# EAGLE design Blocky_STM_Zero (EAGLE 9.1.3)
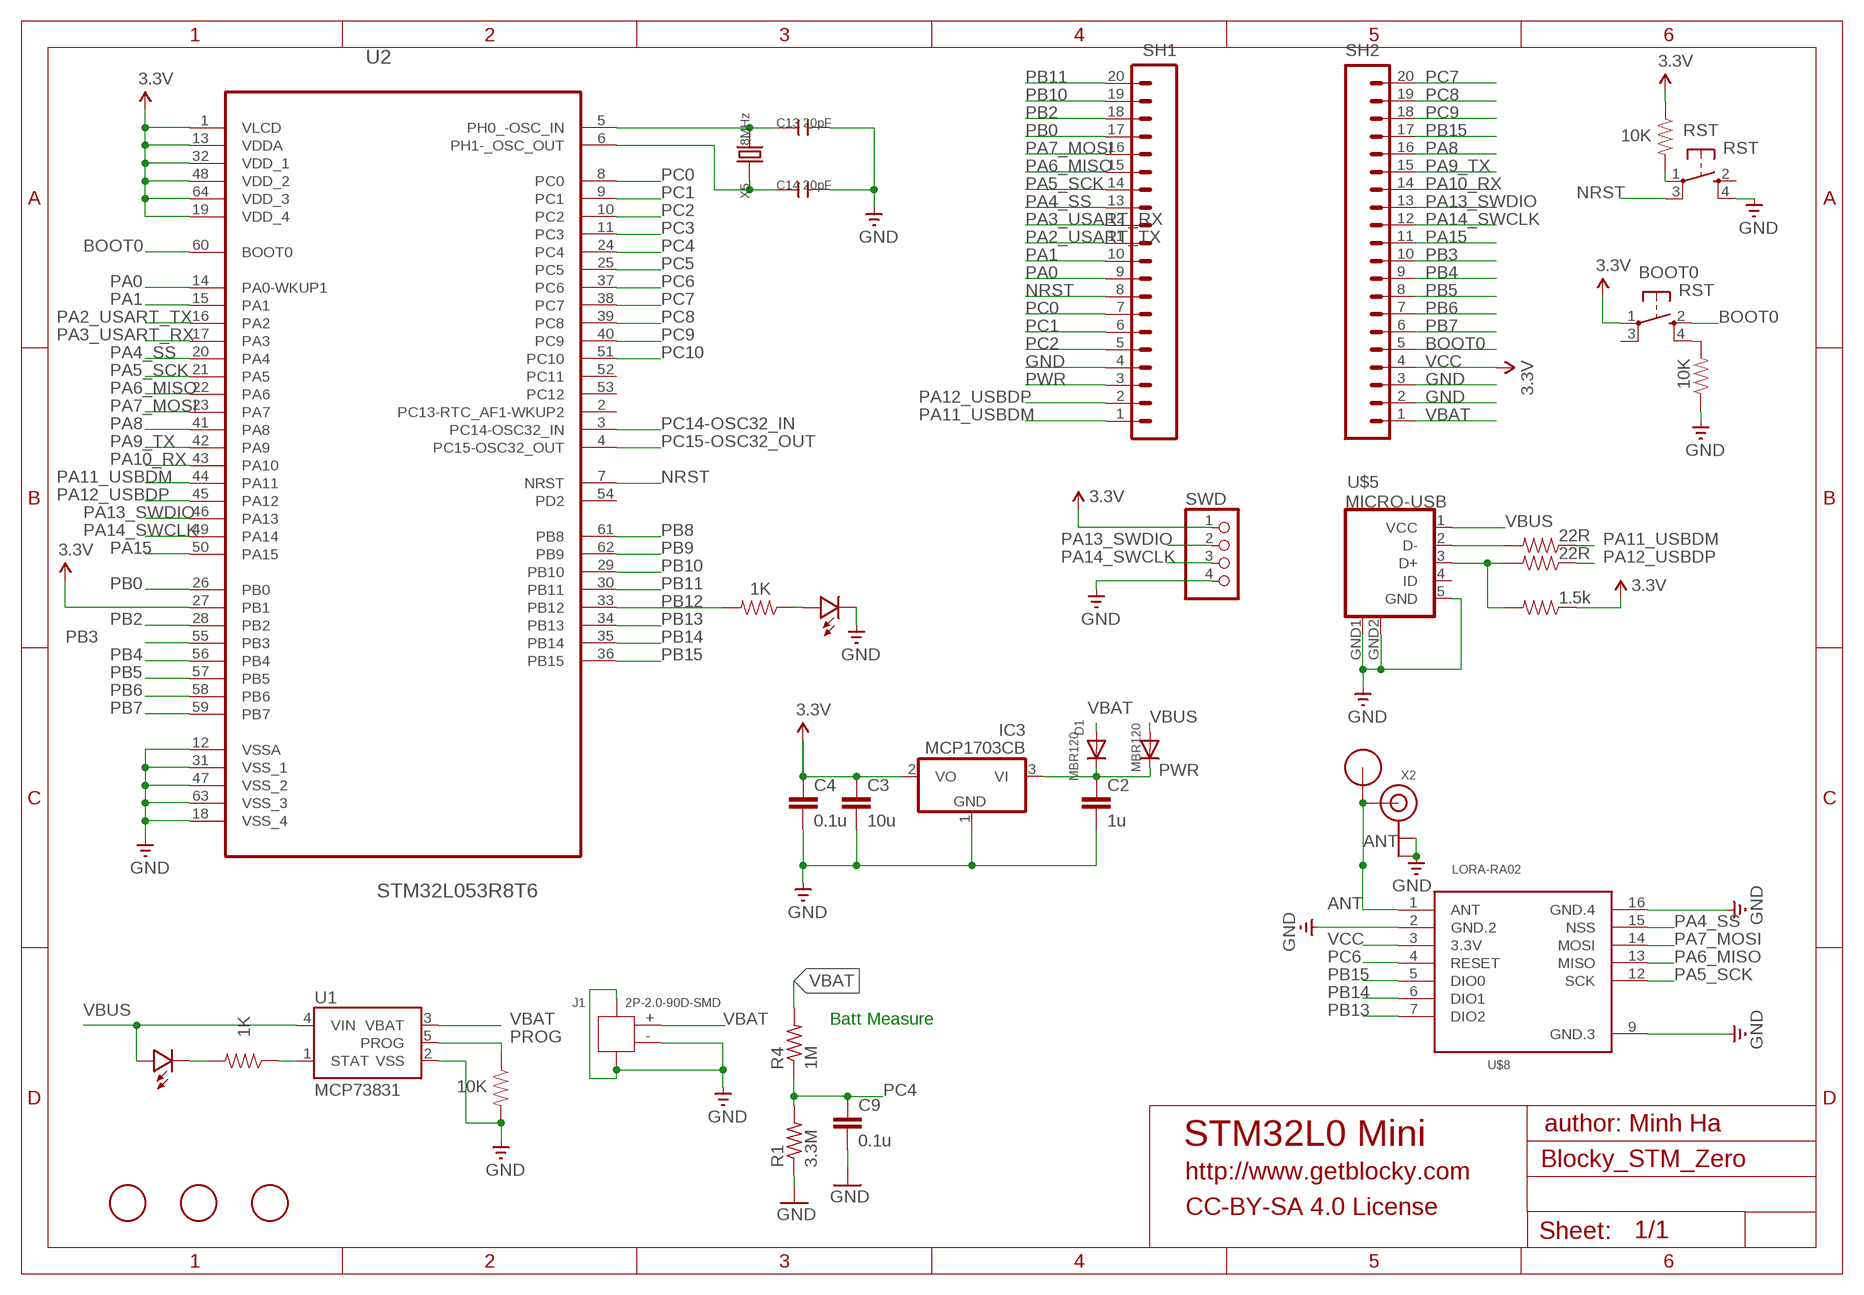
[diagram p0: schematic, sheet 1]

## Parts
BOOT0  RST  SPST_TACT-KMR2  [KMR2]
C2  1u  CAP0603-CAP  [0603-CAP]
C3  10u  CAP0603-CAP  [0603-CAP]
C4  0.1u  CAP0603-CAP  [0603-CAP]
C9  0.1u  CAP0603-CAP  [0603-CAP]
C13  20pF  C-0603  [C0603]
C14  20pF  C-0603  [C0603]
CHGR  RED  LED0603  [0603-LED]
D1  MBR120  DIODESOD-123  [SOD-123]
IC3  MCP1703CB  [SOT23]
J1  2P-2.0-90D-SMD  CONN-HEADER-SMD-PH-SIDE-(2P-2.0MM)  [HW2-SMD-2.0-90D]
MBR0001  MBR120  DIODESOD-123  [SOD-123]
R1  3.3M  R-US_R0603  [R0603]
R2  1K  RESISTOR0603-RES  [0603-RES]
R3  22R  RESISTOR0603-RES  [0603-RES]
R4  1M  R-US_R0603  [R0603]
R5  1K  RESISTOR0603-RES  [0603-RES]
R6  10K  RESISTOR0603-RES  [0603-RES]
R7  22R  RESISTOR0603-RES  [0603-RES]
R8  1.5k  RESISTOR0603-RES  [0603-RES]
R9  10K  RESISTOR0603-RES  [0603-RES]
R10  10K  RESISTOR0603-RES  [0603-RES]
RST  RST  SPST_TACT-KMR2  [KMR2]
SH1  M20  [1X20]
SH2  M20  [1X20]
SWD  HEADER-1X4ROUND  [1X04_ROUND]
U1  MCP73831  [SOT23-5]
U2  STM32L053R8T6  STM32L152RBT6  [QFP50P1200X1200X160-64N]
U$1  RFM12B_ANTENNA  [RFM12B-ANTENNA]
U$2  FIDUCIAL  [FIDUCIAL_1MM]
U$4  FIDUCIAL  [FIDUCIAL_1MM]
U$5  MICRO-USB  [MICRO-USB]
U$6  LED0603  [0603-LED]
U$7  FIDUCIAL  [FIDUCIAL_1MM]
U$8  LORA-RA02  LORA-RA-02-433MHZ  [LORA-RA2-SMD]
X2  ANTENNA_U.FL  [U.FL]
X5  8MHz  CRYSTAL'5032'  [2P-SMD-5X3.2]

## Nets
ANT [power]: U$1.P$1 U$8.1(ANT) X2.3(SIGNAL)
BOOT0: BOOT0.2(S) SH2.5 U2.60(BOOT0)
GND: C2.2 C3.2 C4.2 C9.2 C13.2 C14.2 IC3.1(GND) J1.3 J1.4 J1.- R1.1 R6.2 R9.1 RST.4(S1) SH1.4 SH2.2 SH2.3 SWD.4 U1.2(VSS) U2.12(VSSA) U2.18(VSS_4) U2.31(VSS_1) U2.47(VSS_2) U2.63(VSS_3) U$5.5(GND) U$5.GND1(GND) U$5.GND2(GND) U$6.MINUS U$8.2(GND.2) U$8.9(GND.3) U$8.16(GND.4) X2.1(GND) X2.2(GND)
N$1: BOOT0.4(S1) R9.2
N$2: R2.1 U$6.PLUS
N$9: CHGR.MINUS R5.2
NRST: RST.3(P1) SH1.8 U2.7(NRST)
OSC_IN: C13.1 U2.5(PH0_-OSC_IN) X5.2
OSC_OUT: C14.1 U2.6(PH1-_OSC_OUT) X5.1
PA0: SH1.9 U2.14(PA0-WKUP1)
PA1: SH1.10 U2.15(PA1)
PA2_USART_TX: SH1.11 U2.16(PA2)
PA3_USART_RX: SH1.12 U2.17(PA3)
PA4_SS: SH1.13 U2.20(PA4) U$8.15(NSS)
PA5_SCK: SH1.14 U2.21(PA5) U$8.12(SCK)
PA6_MISO: SH1.15 U2.22(PA6) U$8.13(MISO)
PA7_MOSI: SH1.16 U2.23(PA7) U$8.14(MOSI)
PA8: SH2.16 U2.41(PA8)
PA9_TX: SH2.15 U2.42(PA9)
PA10_RX: SH2.14 U2.43(PA10)
PA11_USBDM: R3.1 SH1.1 U2.44(PA11)
PA12_USBDP: R7.1 SH1.2 U2.45(PA12)
PA13_SWDIO: SH2.13 SWD.2 U2.46(PA13)
PA14_SWCLK: SH2.12 SWD.3 U2.49(PA14)
PA15: SH2.11 U2.50(PA15)
PB0: SH1.17 U2.26(PB0)
PB2: SH1.18 U2.28(PB2)
PB3: SH2.10 U2.55(PB3)
PB4: SH2.9 U2.56(PB4)
PB5: SH2.8 U2.57(PB5)
PB6: SH2.7 U2.58(PB6)
PB7: SH2.6 U2.59(PB7)
PB8: U2.61(PB8)
PB9: U2.62(PB9)
PB10: SH1.19 U2.29(PB10)
PB11: SH1.20 U2.30(PB11)
PB12: R2.2 U2.33(PB12)
PB13: U2.34(PB13) U$8.7(DIO2)
PB14: U2.35(PB14) U$8.6(DIO1)
PB15: SH2.17 U2.36(PB15) U$8.5(DIO0)
PC0: SH1.7 U2.8(PC0)
PC1: SH1.6 U2.9(PC1)
PC2: SH1.5 U2.10(PC2)
PC3: U2.11(PC3)
PC4: C9.1 R1.2 R4.1 U2.24(PC4)
PC5: U2.25(PC5)
PC6: U2.37(PC6) U$8.4(RESET)
PC7: SH2.20 U2.38(PC7)
PC8: SH2.19 U2.39(PC8)
PC9: SH2.18 U2.40(PC9)
PC10: U2.51(PC10)
PC14-OSC32_IN: U2.3(PC14-OSC32_IN)
PC15-OSC32_OUT: U2.4(PC15-OSC32_OUT)
PROG: R6.1 U1.5(PROG)
PWR [power]: C2.1 D1.C IC3.3(VI) MBR0001.C SH1.3
RST_1: R10.2 RST.1(P)
STAT: R5.1 U1.1(STAT)
USB_D+: R7.2 R8.2 U$5.3(D+)
USB_D-: R3.2 U$5.2(D-)
VBAT [power]: D1.A J1.+ R4.2 SH2.1 U1.3(VBAT)
VBUS [usbvcc]: CHGR.PLUS MBR0001.A U1.4(VIN) U$5.1(VCC)
VCC [power]: BOOT0.1(P) C3.1 C4.1 IC3.2(VO) R8.1 R10.1 SH2.4 SWD.1 U2.1(VLCD) U2.13(VDDA) U2.19(VDD_4) U2.27(PB1) U2.32(VDD_1) U2.48(VDD_2) U2.64(VDD_3) U$8.3(3.3V) ; supply symbol labelled 3.3V
Unconnected: BOOT0.3(P1) RST.2(S) U2.2(PC13-RTC_AF1-WKUP2) U2.52(PC11) U2.53(PC12) U2.54(PD2) U$5.4(ID)

## Notes on the sheet
- Batt Measure
- author: Minh Ha
- STM32L0 Mini
- http://www.getblocky.com
- CC-BY-SA 4.0 License

## Library data of the parts
BOOT0 RST = adafruit:SPST_TACT: SMT 6mm switch, EVQQ2 series http://www.ladyada.net/library/eagle
C2-C4 C9 = LowPowerLab:CAP: Capacitor Standard 0603 ceramic capacitor, and 0.1" leaded capacitor.
C13 C14 = Discrete:C*: Ceramic Capacitors
CHGR U$6 = LowPowerLab:LED
D1 MBR0001 = adafruit:DIODE: Diode SMADIODE - SMA Surface Mount Package 20V 1A Schottky Diode Digikey: 641-1014-6-ND DO-1N4148 - Through Hole Small Current Diode SOD-123 20V 1 A (.5mV Vf) Schottky Diode - Digikey: MBRX120TPMSCT-ND SOD-323 10V 570mA (.38mV Vf, 3ns) Schottky Diode - Digikey: ZLLS410CT-ND SOD-523 30V 30mA Schottky Diode (RB751S-40TE61) - Digikey: RB751S-40TE61CT-ND SOT23-R/W - SOT23 Package (R = Solder Paste/Reflow Ovens, W = Hand-Soldering) BAT54Film 40V 300mA - Digikey: 497-7162-1-ND
IC3 = linear:MCP1703: 250 mA, 16V, Low Quiescent Current LDO Regulator Source: http://ww1.microchip.com/downloads/en/DeviceDoc/22049b.pdf
J1 = Seeed-Connector:CONN-HEADER-SMD-PH-SIDE-(2P-2.0MM): 320110026
R1 R4 = adafruit:R-US_: RESISTOR, American symbol
R2 R3 R5-R10 = LowPowerLab:RESISTOR: Resistor Basic schematic elements and footprints for 0603, 1206, and PTH resistors.
SH1 SH2 = SparkFun-Connectors:M20: 1x20 .1" header This is just like the LOCK variant in that the holes are staggared by 5 mil, but except for the last two holes. They are not altered from the "standard" footprint layout. This is used for a special purpose on the layout of our Graphic LCD Backpack. Make sure you want to use this device before selecting it for you project!
SWD = microbuilder:HEADER-1X4: PIN HEADER
U1 = SparkFun-PowerIC:MCP73831: Miniature single cell, fully integrated Li-Ion, Li-polymer charge management controller http://ww1.microchip.com/downloads/en/DeviceDoc/20001984g.pdf IC-09995; PROD_ID: IC-09995
U2 = PatternAgents-STM:STM32L152RBT6: STM32L152RBT6 ARM-based 32-bit MCU, 16 to 64-KB Flash, timers, ADC, DAC and communication interfaces, 2.0-3.6 V PatternAgents ST Microelectronics Component Library Source LBR : http://www.patternagents.com Github : https://github.com/patternagents License : http://creativecommons.org/licenses/by-sa/4.0/ (Creative Commons 4.0) THIS SOFTWARE IS PROVIDED BY THE CONTRIBUTORS "AS IS" AND WITHOUT ANY EXPRESS OR IMPLIED WARRANTIES, INCLUDING, BUT NOT LIMITED TO, THE IMPLIED WARRANTIES OF MERCHANTABILITY AND FITNESS FOR A PARTICULAR PURPOSE ARE DISCLAIMED. IN NO EVENT SHALL THE COPYRIGHT OWNER OR CONTRIBUTORS BE LIABLE FOR ANY DIRECT, INDIRECT, INCIDENTAL, SPECIAL, EXEMPLARY, OR CONSEQUENTIAL DAMAGES (INCLUDING, BUT NOT LIMITED TO, PROCUREMENT OF SUBSTITUTE GOODS OR SERVICES; LOSS OF USE, DATA, OR PROFITS; OR BUSINESS INTERRUPTION) HOWEVER CAUSED AND ON ANY THEORY OF LIABILITY, WHETHER IN CONTRACT, STRICT LIABILITY, OR TORT (INCLUDING NEGLIGENCE OR OTHERWISE) ARISING IN ANY WAY OUT OF THE USE OF THIS SOFTWARE, EVEN IF ADVISED OF THE POSSIBILITY OF SUCH DAMAGE.; MPN: STM32L152RBT6; PACKAGE: QFP-64; SUPPLIER: STMICROELECTRONICS
U$1 = LowPowerLab:RFM12B_ANTENNA
U$2 U$4 U$7 = adafruit:FIDUCIAL: For use by pick and place machines to calibrate the vision/machine, 1mm By microbuilder.eu
U$5 = My-Eagle-Lib:MICRO-USB: Micro USB B connector
U$8 = LikeCircuit:LORA-RA-02-433MHZ: 433 MHz Lora Ra-02 Radio Transceiver Module based on SX1276 chip. Visit our more eagle PCB <https://www.likecircuit.com/>
X2 = adafruit:ANTENNA_U.FL: U.FL Antenna Connector
X5 = Discrete:CRYSTAL*: CRYSTAL

## Net classes
1 power: width 0.203 mm, clearance 0.203 mm
3 usbvcc: width 0.203 mm, drill 0.305 mm, clearance 0.203 mm

## Board
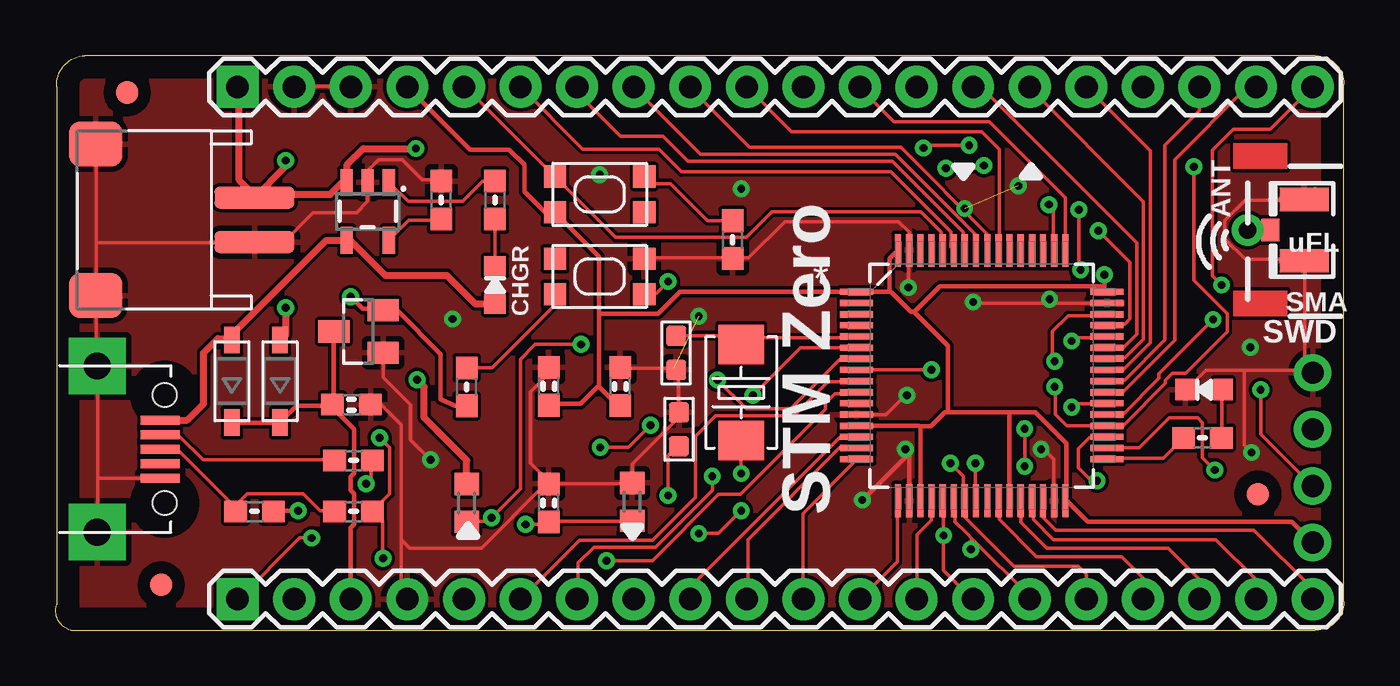
[diagram p1: board, top side]
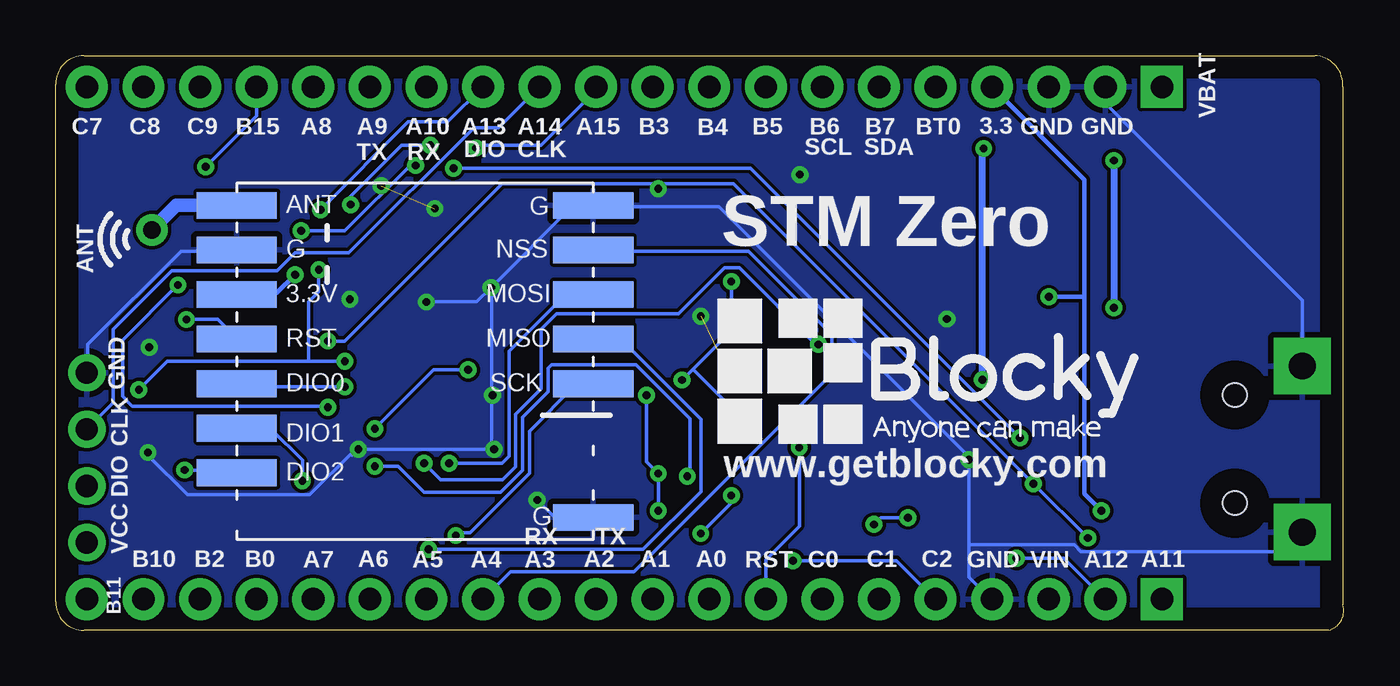
[diagram p2: board, bottom side, seen from below]

Size 57.82 x 25.78 mm. Coordinates in mm from the lower left corner, seen from the top.
Outline: 0.67,0 56.55,0 arc90 57.82,1.27 57.82,24.51 arc90 56.55,25.78 1.31,25.78 arc90 0.04,24.38 0.04,1.14 arc90 0.67,0
Copper layers (1*16): Top 0.035mm / dielectric 1.5mm / Bottom 0.035mm
Design rules "default": minimum track width 6mil, minimum drill 0.35mm, track to track 6mil, track to pad 6mil, pad to pad 6mil, via to via 6mil, smd to smd 6mil, copper to edge 40mil, drill to drill 6mil, minimum pad ring 10mil, minimum via ring 8mil, stop-mask expansion 4mil, vias tented up to drill 0mil, thermal gap 10mil

### Footprints (pad centres in the part's own frame; a part is rotated, then mirrored left to right if it is on the bottom)
KMR2 = smd 1 x 1: 1 2,0.8; 2 2,-0.8; 3 -2,0.8; 4 -2,-0.8
0603-CAP = smd 1.016 x 0.965: 1 -0.85,0; 2 0.85,0
C0603 = smd 0.889 x 0.889: 1 -0.762,0; 2 0.762,0
0603-LED = smd 0.864 x 0.965: MINUS -0.85,0; PLUS 0.85,0
SOD-123 = smd 1.2 x 0.7: A 1.85,0; C -1.85,0
SOT23 = smd 1 x 1.4: 1 -0.95,-1.1; 2 0.95,-1.1; 3 0,1.1
HW2-SMD-2.0-90D = smd 2 x 2.4: 3 3.4,-2.181; 4 -3.4,-2.181 | smd 1 x 3.6: + -1,4.953; - 1,4.953
R0603 = smd 1 x 1.1: 1 -0.85,0; 2 0.85,0
0603-RES = smd 1.016 x 0.965: 1 -0.85,0; 2 0.85,0
1X20 = drill 1.016 pad 1.88 square: 1 0,0 | drill 1.016 pad 1.88: 2 2.54,0; 3 5.08,0; 4 7.62,0; 5 10.16,0; 6 12.7,0; 7 15.24,0; 8 17.78,0; 9 20.32,0; 10 22.86,0; 11 25.4,0; 12 27.94,0; 13 30.48,0; 14 33.02,0; 15 35.56,0; 16 38.1,0; 17 40.64,0; 18 43.18,0; 19 45.72,0; 20 48.26,0
1X04_ROUND = drill 1 pad 1.676: 1 -3.81,0; 2 -1.27,0; 3 1.27,0; 4 3.81,0
SOT23-5 = smd 0.55 x 1.2: 1 -0.95,-1.3; 2 0,-1.3; 3 0.95,-1.3; 4 0.95,1.3; 5 -0.95,1.3
QFP50P1200X1200X160-64N = smd 1.473 x 0.279: 1 -5.613,3.759; 2 -5.613,3.251; 3 -5.613,2.743; 4 -5.613,2.261; 5 -5.613,1.753; 6 -5.613,1.245; 7 -5.613,0.762; 8 -5.613,0.254; 9 -5.613,-0.254; 10 -5.613,-0.762; 11 -5.613,-1.245; 12 -5.613,-1.753; 13 -5.613,-2.261; 14 -5.613,-2.743; 15 -5.613,-3.251; 16 -5.613,-3.759; 33 5.613,-3.759; 34 5.613,-3.251; 35 5.613,-2.743; 36 5.613,-2.261; 37 5.613,-1.753; 38 5.613,-1.245; 39 5.613,-0.762; 40 5.613,-0.254; 41 5.613,0.254; 42 5.613,0.762; 43 5.613,1.245; 44 5.613,1.753; 45 5.613,2.261; 46 5.613,2.743; 47 5.613,3.251; 48 5.613,3.759 | smd 0.279 x 1.473: 17 -3.759,-5.613; 18 -3.251,-5.613; 19 -2.743,-5.613; 20 -2.261,-5.613; 21 -1.753,-5.613; 22 -1.245,-5.613; 23 -0.762,-5.613; 24 -0.254,-5.613; 25 0.254,-5.613; 26 0.762,-5.613; 27 1.245,-5.613; 28 1.753,-5.613; 29 2.261,-5.613; 30 2.743,-5.613; 31 3.251,-5.613; 32 3.759,-5.613; 49 3.759,5.613; 50 3.251,5.613; 51 2.743,5.613; 52 2.261,5.613; 53 1.753,5.613; 54 1.245,5.613; 55 0.762,5.613; 56 0.254,5.613; 57 -0.254,5.613; 58 -0.762,5.613; 59 -1.245,5.613; 60 -1.753,5.613; 61 -2.261,5.613; 62 -2.743,5.613; 63 -3.251,5.613; 64 -3.759,5.613
RFM12B-ANTENNA = drill 0.8 pad 1.422: P$1 0,0
FIDUCIAL_1MM = smd 1 x 1: 1 0,0
MICRO-USB = smd 0.4 x 1.75: 1 -1.3,4.525; 2 -0.65,4.525; 3 0,4.525; 4 0.65,4.525; 5 1.3,4.525 | drill 1.2 pad 2.54 square: GND1 -3.725,1.7; GND2 3.725,1.7 | hole 1.05: -2.425,4.73; 2.425,4.73
LORA-RA2-SMD = smd 3.6 x 1.2: 1 -8,7; 2 -8,5; 3 -8,3; 4 -8,1; 5 -8,-1; 6 -8,-3; 7 -8,-5; 9 8,-7; 12 8,-1; 13 8,1; 14 8,3; 15 8,5; 16 8,7
U.FL = smd 2.2 x 1.05: 1 0,1.375; 2 0,-1.375 | smd 0.8 x 1: 3 1.525,0
2P-SMD-5X3.2 = smd 1.778 x 2.032: 1 -2.159,0; 2 2.159,0

### Placement (x,y rotation side)
BOOT0  24.42,19.56 180 top
C2  13.28,10.12 0 top
C3  25.34,10.94 90 top
C4  22.13,10.95 90 top
C9  22.13,5.71 90 top
C13  27.85,12.45 270 top
C14  27.98,9.02 90 top
CHGR  19.72,15.49 270 top
D1  10.07,11.18 90 top
IC3  13.59,13.41 90 top
J1  3.97,18.42 270 top
MBR0001  7.91,11.18 90 top
R1  25.87,5.76 270 top
R2  51.47,8.64 180 top
R3  13.37,7.62 180 top
R4  18.45,5.71 90 top
R5  19.72,19.3 270 top
R6  17.31,19.3 90 top
R7  13.37,5.33 180 top
R8  8.93,5.33 180 top
R9  30.39,17.53 90 top
R10  18.45,10.92 90 top
RST  24.42,15.87 180 top
SH1  8.16,1.4 0 top
SH2  8.16,24.38 0 top
SWD  56.42,7.75 90 top
U1  14.01,18.8 180 top
U2  41.56,11.43 0 top
U$1  53.5,17.96 0 top
U$2  53.97,6.1 0 top
U$3  [BLOCKY_LOGO]  29.12,8.13 0 bottom
U$4  4.73,2.03 0 top
U$5  0.16,8.13 270 top
U$6  51.55,10.79 0 top
U$7  3.21,24.13 0 top
U$8  41.69,12.06 0 bottom
X2  56.04,17.96 180 top
X5  30.77,10.67 90 top

### Tracks (layer width: path | path; a pad name or v marks a point on that pad's centre or on a via)
ANT
  Top 0.203: X2.3 54.47,18.01 53.55,18.01 U$1.P$1
  Bottom 0.203: 53.48,18.01 U$1.P$1
  Bottom 0.61: U$8.1 52.42,19.07 53.48,18.01
BOOT0
  Top 0.152: SH2.5 18.35,24.41 22.39,20.37 BOOT0.2 22.46,20.3 25.13,17.63 31,17.63 32.14,18.77 38.85,18.77 39.76,17.86 39.76,17.09 U2.60
GND  (via drill 0.35)  (2 unrouted)
  Top 0.152: U2.12 37.27,9.68 38.01,10.41 38.09,10.41 v38.21,10.54 | v38.28,15.38 38.28,17.01 U2.63 38.31,17.09 38.31,17.86 37.83,18.34 32.73,18.34 31.1,16.71 30.39,16.71 | v41.18,14.73 41.23,14.68 U2.47 | U2.31 44.82,7.67 44.36,8.13 v44.23,8.13 | 56.07,11.53 56.37,11.53 SWD.4 56.07,11.53 | 56.07,11.66 53.35,11.66 | U$6.MINUS 50.73,10.85 50.81,10.85 51.62,11.66 52.97,11.66 53.1,11.66 53.35,11.66 | 56.07,11.66 56.07,16.51 | 56.07,16.51 56.07,16.56 X2.1 55.99,16.64 53.4,16.64 52.49,17.55 52.49,18.39 53.4,19.3 55.99,19.3 X2.2 56.07,19.38 56.53,19.84 | 30.39,16.71 26.43,16.71 RST.4 | 30.39,16.71 R9.1 30.39,16.71 | 53.35,11.66 53.35,11.53 53.35,8.31 v53.68,7.98 | 27.95,9.78 27.95,11.61 27.87,11.68 C13.2 27.8,11.68 27.72,11.76 25.36,11.76 C3.2 | 27.95,9.78 C14.2 27.95,9.78 | C9.2 22.16,6.58 25.82,6.58 R1.1 25.89,6.66 25.89,7.47 27.95,9.52 27.95,9.78 | C4.2 22.08,11.76 22.08,11.46 21.32,10.69 21.32,7.49 22.16,6.66 C9.2 | 15.5,4.06 15.5,1.4 SH1.4 | 15.5,4.06 15.5,9.22 14.6,10.12 C2.2 | IC3.1 14.69,11.35 15.94,10.11 15.94,8.53 v16.82,7.65 | C9.2 22.08,6.5 21.93,6.5 19.11,3.68 15.89,3.68 15.5,4.06 | R6.2 17.28,20.22 16.44,20.22 15.55,21.11 14.49,21.11 14.01,20.62 14.01,20.14 U1.2 14.01,20.07 14.01,19.25 13.5,18.75 11.55,18.75 10.22,17.42 J1.- 8.9,17.4 1.81,17.4 | SH2.2 10.73,24.41 13.24,24.41 SH2.3 | 1.81,17.4 1.81,15.04 J1.3 1.81,14.96 1.81,11.91 U$5.GND1 1.89,11.84 1.89,6.73 | 1.81,17.4 1.81,21.74 J1.4 | 1.89,6.73 1.89,4.45 U$5.GND2 | U$5.5 1.99,6.83 1.89,6.73 | 56.07,15.6 56.07,16.51 | 56.07,11.53 56.07,11.66
  Top 0.203: U2.18 38.31,7.95 v38.14,8.13 38.14,7.77 v36.21,5.84
  Bottom 0.152: v38.28,15.38 38.26,15.37 38.26,10.59 v38.21,10.54 38.26,10.49 38.26,8.13 | v38.28,15.38 38.92,14.73 v41.18,14.73 | 38.26,8.13 v44.23,8.13 44.51,7.85 44.51,7.98 46.42,6.07 51.9,6.07 53.68,7.85 v53.68,7.98 | U$8.2 49.74,17.02 52.18,17.02 56.37,12.83 56.37,11.61 SWD.4 | v36.21,5.84 35.49,5.13 33.74,5.13 U$8.9 | v38.28,15.38 38.24,15.42 34.66,19 33.74,19 U$8.16 33.67,19 28.05,19 16.7,7.65 v16.82,7.65 16.82,3.83 | 16.82,3.83 16.82,2.39 15.83,1.4 SH1.4 | SH2.2 10.65,24.33 10.65,23.6 1.86,14.81 U$5.GND1 | 16.82,3.83 12.1,3.83 11.8,3.53 2.73,3.53 1.89,4.37 U$5.GND2 | v38.14,8.13 38.26,8.13
  other vias: 17.82,13.97 28.86,14.1 40.8,18.92 44.61,14.86 53.63,12.7 30.77,19.81 43.22,19.94 24.42,20.45
  pour Top: 57.82,25.91 57.82,0 0.04,0 0.04,25.91
  pour Bottom: 0.04,25.91 0.04,0 57.82,0 57.82,25.91
N$1
  Top 0.152: BOOT0.4 26.45,20.04 27.59,20.04 29.26,18.38 R9.2
N$2
  Top 0.152: U$6.PLUS 52.33,10.77 52.33,8.64 R2.1
N$9
  Top 0.152: CHGR.MINUS 19.72,16.41 19.72,18.39 R5.2
NRST  (via drill 0.35)
  Top 0.152: v27.49,15.65 26.96,15.11 26.43,15.11 RST.3 | v29.7,11.23 31,9.93 32.98,9.93 35.19,12.14 35.95,12.14 U2.7 | v26.71,9.19 25.71,8.2 v24.44,8.2
  Bottom 0.152: v27.49,15.65 27.49,13.44 29.19,11.73 29.22,11.71 | v29.7,11.23 29.25,11.68 | 29.25,11.68 29.22,11.71 | v24.44,8.2 24.44,4.67 25.94,3.17 SH1.8 | 29.22,11.71 v26.71,9.19 | 29.25,11.68 29.22,11.71
OSC_IN
  Top 0.152: C13.1 27.87,13.21 30.39,13.21 X5.2 30.77,12.9 31,13.13 35.95,13.13 U2.5
OSC_OUT  (via drill 0.35)
  Top 0.152: v28.86,4.34 29.75,4.34 v30.77,5.36 | v30.77,7.04 30.77,8.48 X5.1 | U2.6 33.44,12.67 v31.3,10.54 | v27.49,6.04 27.49,7.82 27.92,8.25 C14.1
  Bottom 0.152: v30.77,5.36 v30.77,7.04 31.3,7.57 v31.3,10.54 | v28.86,4.34 27.47,5.74 27.47,6.02 v27.49,6.04
PA0
  Top 0.152: SH1.9 28.48,1.93 35.19,8.64 35.95,8.64 U2.14
PA1
  Top 0.152: U2.15 35.19,8.18 31.07,4.06 31.07,1.4 SH1.10
PA2_USART_TX
  Top 0.152: U2.16 35.95,7.65 33.54,5.23 33.54,1.42 SH1.11
PA3_USART_RX
  Top 0.152: SH1.12 37.78,3.07 37.78,5.82 U2.17
PA4_SS
  Top 0.152: SH1.13 38.67,1.4 38.67,4.29 39.3,4.93 U2.20
  Bottom 0.152: U$8.15 33.67,17.02 26.73,17.02 22.97,13.26 22.97,11.51 31.86,2.62 37.4,2.62 38.62,1.4 SH1.13
PA5_SCK  (via drill 0.35)
  Top 0.152: U2.21 39.84,5.82 39.84,4.32 39.84,4.29 v39.86,4.25 39.84,4.27 39.84,2.69 41.13,1.4 SH1.14
  Bottom 0.152: U$8.12 33.74,11 34.5,11 36.56,8.94 36.56,7.04 39.23,4.37 39.79,4.37 39.79,4.32 v39.86,4.25
PA6_MISO  (via drill 0.35)
  Top 0.152: 41.16,4.09 43.72,1.52 SH1.15 | U2.22 40.37,5.82 40.37,4.88 40.9,4.34 41.16,4.09 | 41.16,4.09 41.08,4.01 v41.08,3.63
  Bottom 0.152: v41.08,3.63 31.46,3.63 28.86,6.22 28.86,9.47 32.45,13.06 33.67,13.06 U$8.13
PA7_MOSI  (via drill 0.35)
  Top 0.152: v40.17,7.49 40.75,6.91 40.75,5.82 U2.23 40.83,5.82 40.83,5.06 43.01,2.87 45.91,2.87 46.26,2.51 SH1.16
  Bottom 0.152: U$8.14 33.74,15.04 34.96,15.04 37.48,12.52 37.48,7.81 37.79,7.49 v40.17,7.49
PA8
  Top 0.152: U2.41 47.23,11.68 47.91,11.68 49.13,12.9 49.13,21.51 46.31,24.33 SH2.16
PA9_TX
  Top 0.152: U2.42 47.23,12.22 47.99,12.22 48.83,13.06 48.83,19.23 43.72,24.33 SH2.15
PA10_RX
  Top 0.152: U2.43 47.23,12.67 47.91,12.67 48.52,13.28 48.52,17.4 41.54,24.38 SH2.14
PA11_USBDM  (via drill 0.35)
  Top 0.152: v13.93,6.58 14.16,6.81 14.16,7.57 R3.1 | v11.49,4.14 10.96,4.14 8.21,1.4 SH1.1 | v45.6,12.98 45.76,13.13 47.15,13.13 U2.44
  Bottom 0.152: v11.49,4.14 v13.93,6.58 27.39,20.04 37.78,20.04 44.84,12.98 v45.6,12.98
PA12_USBDP  (via drill 0.35)
  Top 0.152: v46.8,17.93 48.22,16.51 48.22,13.97 47.99,13.74 47.23,13.74 U2.45 | v39.96,20.73 41.54,20.73 v41.67,20.85 | v14.54,8.64 15,8.18 15,6.12 14.23,5.36 R7.1 14.67,4.89 14.67,3.25 v14.69,3.23
  Bottom 0.152: v14.69,3.23 12.56,3.23 10.73,1.4 SH1.2 | v46.8,17.93 44.84,17.93 41.92,20.85 v41.67,20.85 | v39.96,20.73 26.63,20.73 v14.54,8.64
PA13_SWDIO  (via drill 0.35)
  Top 0.152: v54.09,10.79 54.09,8.79 56.37,6.5 SWD.2 | U2.46 47.15,14.12 45.45,14.12 44.74,13.41 44.74,12.17 v44.84,12.06 | v45.93,18.87 45.93,16.26 v46.01,16.18
  Bottom 0.152: 46.47,12.06 52.82,12.06 v54.09,10.79 | 46.47,12.06 v44.84,12.06 | v45.93,18.87 42,22.81 40.22,22.81 SH2.13 | v46.01,16.18 46.01,15.19 46.47,14.73 46.47,12.06
PA14_SWCLK
  Top 0.152: U2.49 45.32,17.09 45.32,19.41 41.92,22.81 37.63,22.81 36.1,24.33 SH2.12
  Bottom 0.152: SWD.3 55.23,10.21 55.23,10.29 55.23,13.51 52.61,16.13 47.89,16.13 47.08,16.94 44.66,16.94 39.05,22.55 38.14,22.55 37.93,22.55 SH2.12
PA15  (via drill 0.35)
  Top 0.152: v44.59,19.1 44.79,18.9 44.79,17.09 U2.50 | v41.01,21.77 39.08,21.77 v38.95,21.64
  Bottom 0.152: v41.01,21.77 42.3,21.77 44.59,19.48 v44.59,19.1 | SH2.11 33.56,24.23 36.03,21.77 38.82,21.77 v38.95,21.64
PB0
  Top 0.152: U2.26 42.35,5.82 42.35,4.98 44.03,3.3 47.86,3.3 48.8,2.36 SH1.17
PB2
  Top 0.152: U2.28 43.32,4.85 44.49,3.68 49.95,3.68 51.34,2.29 SH1.18
PB3
  Top 0.152: U2.55 42.35,17.09 42.35,21.59 41.56,22.38 33.03,22.38 31.07,24.33 SH2.10
PB4
  Top 0.152: U2.56 41.82,17.09 41.82,17.78 37.93,21.67 31.15,21.67 28.48,24.33 SH2.9
PB5
  Top 0.152: U2.57 41.29,17.09 41.29,17.78 37.7,21.36 28.94,21.36 25.97,24.33 SH2.8
PB6
  Top 0.152: U2.58 40.75,17.09 40.75,17.86 37.55,21.06 28.38,21.06 27.26,22.17 25.36,22.17 23.4,24.13 SH2.7
PB7
  Top 0.152: U2.59 40.18,17.18 40.18,17.88 37.48,20.57 28.1,20.57 27.09,21.59 23.66,21.59 SH2.6
PB10
  Top 0.152: U2.29 43.88,5.82 43.88,4.98 44.79,4.06 52.08,4.06 53.88,2.26 SH1.19
PB11
  Top 0.152: U2.30 44.33,5.82 44.33,5.06 44.89,4.5 53.78,4.5 56.42,1.85 SH1.20
PB12
  Top 0.152: R2.2 50.58,8.64 50.58,8.58 49.72,7.72 47.23,7.72 U2.33
PB13  (via drill 0.35)
  Top 0.152: v52.03,7.19 51.47,7.75 51.47,9.32 51.27,9.52 50,9.52 48.65,8.18 47.23,8.18 U2.34
  Bottom 0.152: v52.03,7.19 49.82,7.19 49.74,7.11 U$8.7
PB14  (via drill 0.35)
  Top 0.152: U2.35 47.15,8.64 46.39,8.64 45.91,8.15 45.91,7.29 46.49,6.71 v46.75,6.71
  Bottom 0.152: v46.75,6.71 46.75,7.62 48.14,9.02 49.67,9.02 U$8.6
PB15  (via drill 0.35)
  Top 0.152: v44.84,10.92 44.87,10.9 44.87,9.7 45.4,9.17 47.15,9.17 U2.36 47.23,9.17 47.91,9.17 49.82,11.07 49.82,11.23 50.12,11.53 50.73,11.53 52.59,13.39 52.59,14.2 51.09,15.7 v51.09,20.8
  Bottom 0.152: v44.84,10.92 49.59,10.92 49.67,11 U$8.5 | v51.09,20.8 48.8,23.09 SH2.17
PC0  (via drill 0.35)
  Top 0.152: v39.3,11.68 U2.8 | v43.49,7.37 v43.49,9.04 | SH1.7 23.45,1.4 23.45,3.02 24.17,3.73 26.93,3.73 29.47,6.27 v29.47,6.91
  Bottom 0.152: v39.3,11.68 40.85,11.68 v43.49,9.04 | v43.49,7.37 42.45,7.37 41.29,6.2 37.86,6.2 36.87,7.19 36.87,9.55 35.72,10.69 35.72,11.76 35.57,11.91 31.76,11.91 29.35,9.5 29.35,7.04 v29.47,6.91
PC1
  Top 0.152: SH1.6 23.51,4.04 26.78,4.04 28.71,5.97 28.71,8.71 29.63,9.63 33.13,9.63 34.66,11.15 35.95,11.15 U2.9
PC2  (via drill 0.35)
  Top 0.152: v24.72,3.12 26.78,3.12 29.75,6.1 30.74,6.1 34.55,9.91 34.55,10.18 34.99,10.62 35.95,10.62 U2.10
  Bottom 0.152: v24.72,3.12 20.08,3.12 18.35,1.4 SH1.5
PC4  (via drill 0.35)
  Top 0.152: R1.2 25.82,4.9 22.16,4.9 C9.1 22.08,4.83 22.01,4.75 v21.09,4.75 | R4.1 18.5,4.9 19.42,4.9 v19.57,5.06 20.86,6.35 20.86,12.17 21.52,12.83 v23.58,12.83 | v41.29,7.49 41.29,5.82 U2.24
  Bottom 0.152: v19.57,5.06 20.79,5.06 v21.09,4.75 | v41.29,7.49 40.55,6.76 37.75,6.76 37.17,7.34 37.17,9.7 36.03,10.85 36.03,13.51 35.34,14.2 29.86,14.2 27.8,16.26 27.14,16.26 23.71,12.83 v23.58,12.83
PC6  (via drill 0.35)
  Top 0.152: v51.95,13.94 49.51,11.51 49.51,11.3 47.91,9.7 47.23,9.7 U2.37
  Bottom 0.152: v51.95,13.94 50.56,13.94 49.74,13.13 U$8.4
PC7  (via drill 0.35)
  Top 0.152: v45.6,10.01 45.76,10.16 47.15,10.16 U2.38 | v52.33,15.49 51.93,15.9 51.93,21.54 52.87,22.48 54.52,22.48 SH2.20
  Bottom 0.152: v52.33,15.49 54.82,13 54.82,10.49 54.39,10.06 52.51,10.06 45.65,10.06 v45.6,10.01
PC8
  Top 0.152: U2.39 47.23,10.69 47.91,10.69 50.23,13 50.23,21.11 53.45,24.33 53.86,24.33 SH2.19
PC9
  Top 0.152: U2.40 47.23,11.23 47.99,11.23 49.79,13.03 49.79,21.77 51.34,23.32 SH2.18
PROG
  Top 0.152: R6.1 17.28,18.39 15.83,18.39 15,17.55 U1.5
PWR
  Top 0.203: C2.1 12.41,10.08 10.81,10.08 10.12,9.4 D1.C 9.97,9.32 MBR0001.C | IC3.3 12.48,13.36 12.48,10.16 C2.1 | SH1.3 13.24,4.6 13.4,4.75 13.4,6.12 13.24,6.27 13.24,6.88 13.4,7.04 13.4,9.02 12.41,10.01 C2.1
RST_1
  Top 0.152: R10.2 19.58,11.77 22.42,14.61 RST.1
STAT
  Top 0.152: R5.1 19.72,20.14 19.16,20.14 18.27,19.25 15.81,19.25 15,20.07 U1.1
USB_D+
  Top 0.152: U$5.3 4.71,8.1 5.47,8.1 8.06,5.51 8.06,5.36 R8.2 8.06,5.59 8.6,6.12 11.11,6.12 11.87,5.36 12.48,5.36 R7.2
USB_D-
  Top 0.152: R3.2 12.48,7.65 6.61,7.65 5.55,8.71 4.71,8.71 U$5.2
VBAT  (via drill 0.35)
  Top 0.203: 10.17,13.11 10.12,13.06 D1.A | 8.98,19.46 J1.+ | SH2.1 8.21,24.33 | 13.09,20.14 U1.3
  Top 0.305: v16.16,21.62 13.8,21.62 13.09,20.9 13.09,20.14 | 8.21,24.33 8.21,20.22 8.98,19.46 9.08,19.56 12.33,19.56 12.87,20.1 U1.3 | J1.+ 10.32,20.81 v10.32,21.08 | v10.32,14.48 10.32,13.26 10.17,13.11 | R4.2 18.45,7.62 16.55,9.52 16.55,10.92 v16.22,11.25
  Bottom 0.305: v10.32,21.08 v10.32,14.48 | v16.22,11.25 16.22,21.41 16.01,21.62 v16.16,21.62
VBUS
  Top 0.203: 13.24,17.48 13.09,17.48 U1.4 | 17.56,15.93 17.56,15.91 | 8.09,13.44 7.91,13.44 7.91,13.06 | 7.91,13.06 MBR0001.A | 7.88,13.08 7.91,13.06
  Top 0.305: 17.56,15.93 14.79,15.93 13.24,17.48 | 8.09,13.44 12.15,17.5 U1.4 | U$5.1 5.91,9.43 6.64,10.16 6.64,12.45 7.27,13.08 7.88,13.08 | 17.56,15.91 18.83,14.64 CHGR.PLUS
VCC  (via drill 0.35)
  Top 0.203: 37.42,15.19 U2.1 35.87,15.19 28.03,15.19 27.04,14.2 24.6,14.2 24.39,14.2 | 38.52,14.3 38.54,14.3 39.68,15.44 46.92,15.44 47.01,15.35 | U2.13 38.75,9.17 38.77,9.14 | 38.77,9.14 38.82,9.09 U2.19 | 40.04,9.78 40.04,12.78 38.52,14.3 | 42.81,9.78 40.17,9.78 40.04,9.78 | 42.81,9.78 42.81,9.27 U2.27 | U2.64 37.42,16.66 37.42,15.19 | 38.52,14.3 38.39,14.3 37.5,15.19 37.42,15.19 | U2.48 47.01,15.35 | 38.77,9.14 39.28,9.14 39.91,9.78 40.04,9.78 | 42.81,9.78 43.98,9.78 45.37,8.38 45.37,5.87 U2.32 45.4,5.82 46.34,4.88 55.48,4.88 SWD.1 | v10.88,5.36 9.81,5.36 R8.1 | v13.24,14.96 13.78,14.43 14.62,14.43 IC3.2 15.32,14.36 17.28,12.39 17.28,10.37 17.92,10.07 R10.1 | 24.39,10.92 24.39,14.2 | 24.39,14.2 24.39,16.76 22.46,18.69 BOOT0.1 21.97,18.76 21.04,19.69 21.04,20.88 20.36,21.57 18.6,21.57 SH2.4 | 24.39,10.92 25.22,10.09 C3.1 | C4.1 22.16,10.16 23.56,10.16 24.32,10.92 24.39,10.92 | v47.08,15.95 47.08,15.42 47.01,15.35
  Bottom 0.203: 11.64,15.04 11.64,20.22 15.76,24.33 SH2.4 | v13.24,14.96 11.72,14.96 11.64,15.04 | v47.08,15.95 47.91,15.11 49.67,15.11 U$8.3 | v10.88,5.36 11.64,6.12 11.64,14.83 11.64,15.04
(copper drawn outside any net)
  shapes: Top area x2

### Text on the board
tPlace: ANT | uFL | SMA | STM Zero
bPlace: STM Zero
tDocu: REG
_tsilk: VBAT | GND | GND | 3.3 | BT0 | B7 | B6 | B5 | B4 | B3 | A15 | A13 | A10 | A9 | A8 | B15 | C9 | C8 | A14 | C7 | SDA | SCL | BOOT0 | CLK | DIO | RX | TX | RESET | STM32L053R8 | LED>B12 | GND | CLK | HSE | DIO | VIN | TX | RX | SS | SK | MI | MO | VCC | A11 | A12 | GND | C2 | C1 | C0 | RST | A0 | A1 | A2 | A3 | A4 | A5 | A6 | A7 | B0 | B2 | B10 | B11
_bsilk: VBAT | GND | GND | 3.3 | BT0 | B7 | B6 | B5 | B4 | B3 | A15 | A14 | A13 | A10 | A9 | A8 | B15 | C9 | C8 | C7 | SDA | SCL | CLK | DIO | RX | TX | ANT | GND | CLK | DIO | TX | RX | VCC | A11 | A12 | VIN | GND | C2 | C1 | C0 | RST | A0 | A1 | A2 | A3 | A4 | A5 | A6 | A7 | B0 | B2 | B10 | B11